# Altium schematic sheet CKP_CMP.SchDoc
size 420 x 297 mm; SheetNumber: 5; SheetTotal: 5
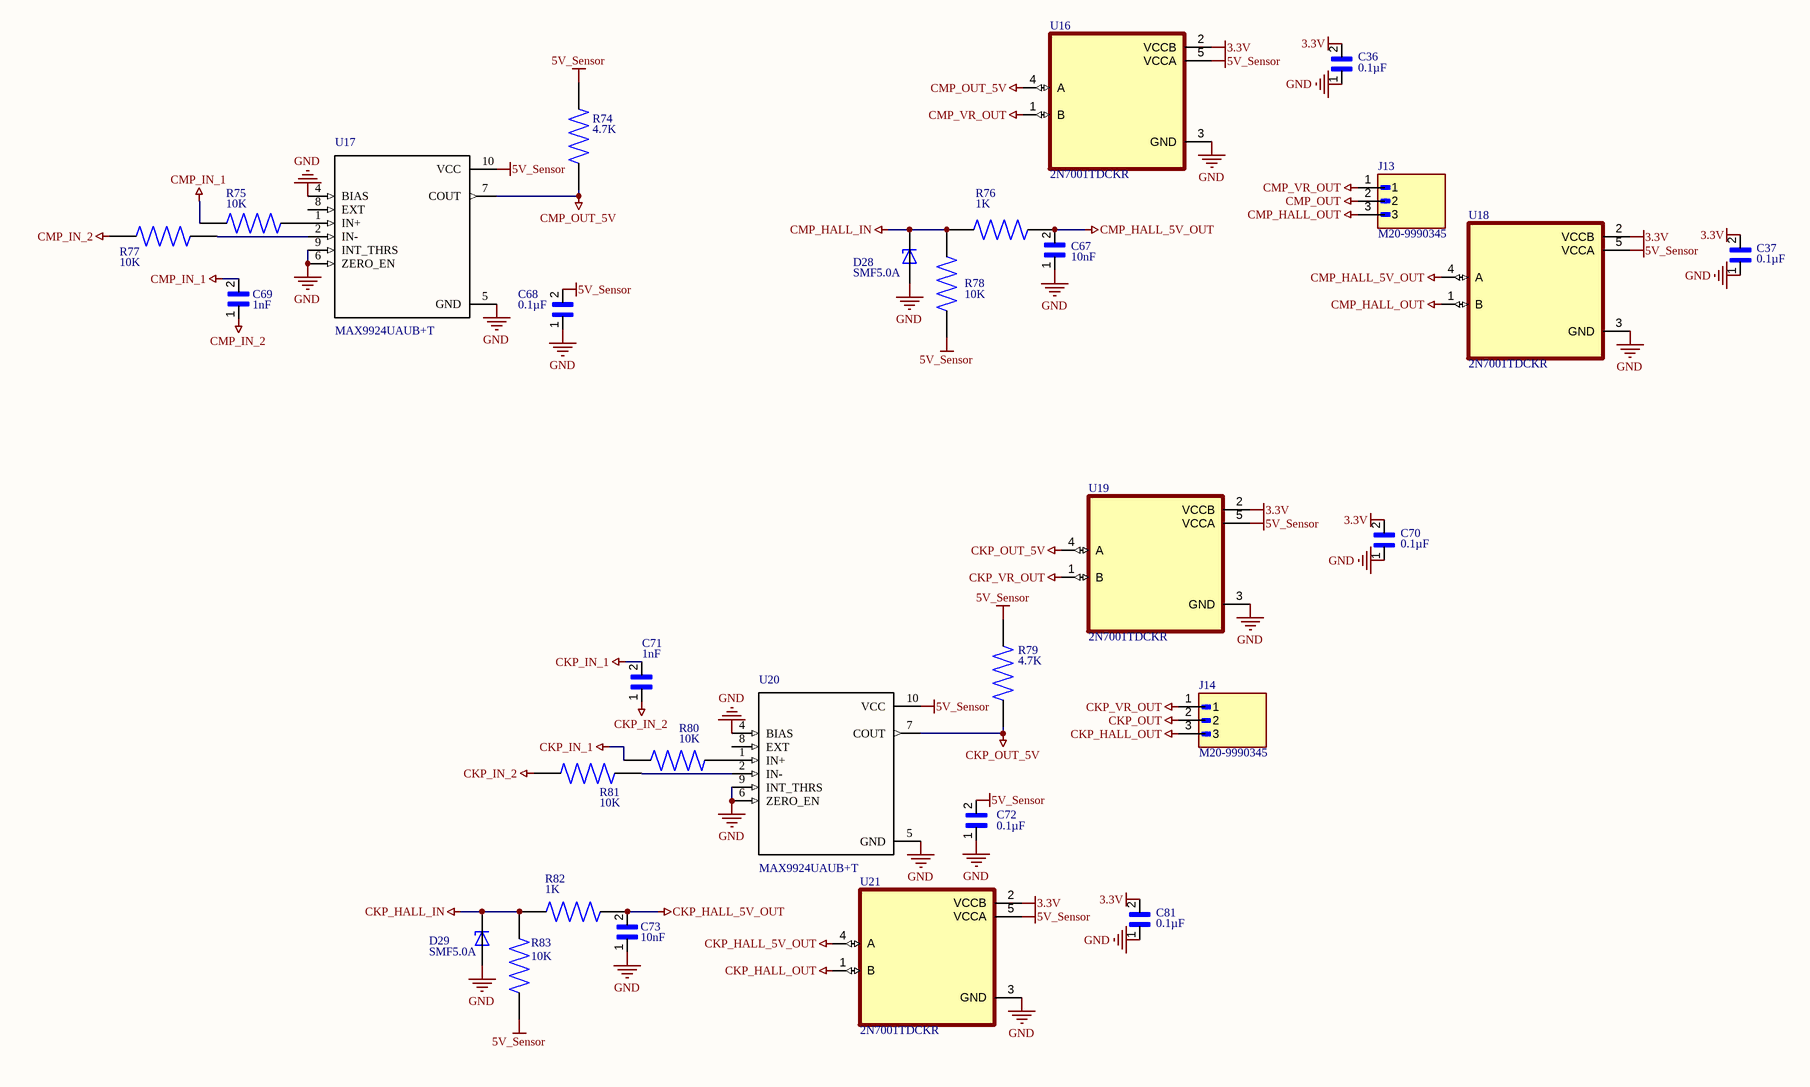
[diagram p0: CKP_CMP.SchDoc]

## Parts
C36  0.1µF  [CAPC1608X90N]
C37  0.1µF  [CAPC1608X90N]
C67  10nF  [CAPC1608X90N]
C68  0.1µF  [CAPC1608X90N]
C69  1nF  [CAPC1608X90N]
C70  0.1µF  [CAPC1608X90N]
C71  1nF  [CAPC1608X90N]
C72  0.1µF  [CAPC1608X90N]
C73  10nF  [CAPC1608X90N]
C81  0.1µF  [CAPC1608X90N]
D28  SMF5.0A  [SODFL3718X102N]
D29  SMF5.0A  [SODFL3718X102N]
J13  M20-9990345  [HARWIN_M20-9990345]
J14  M20-9990345  [HARWIN_M20-9990345]
R74  4.7K  [RESC3116X65N]
R75  10K  [RESC3116X65N]
R76  1K  [RESC3116X65N]
R77  10K  [RESC3116X65N]
R78  10K  [RESC3116X65N]
R79  4.7K  [RESC3116X65N]
R80  10K  [RESC3116X65N]
R81  10K  [RESC3116X65N]
R82  1K  [RESC3116X65N]
R83  10K  [RESC3116X65N]
U16  2N7001TDCKR  [SOT65P210X110-5N]
U17  MAX9924UAUB+T  [*SOP50P490X110-10N]
U18  2N7001TDCKR  [SOT65P210X110-5N]
U19  2N7001TDCKR  [SOT65P210X110-5N]
U20  MAX9924UAUB+T  [*SOP50P490X110-10N]
U21  2N7001TDCKR  [SOT65P210X110-5N]

## Nets
3.3V: C36.2 C37.2 C70.2 C81.2 U16.2(VCCB) U18.2(VCCB) U19.2(VCCB) U21.2(VCCB)
5V_Sensor: C68.2 C72.2 R74.2 R78.1 R79.2 R83.1 U16.5(VCCA) U17.10(VCC) U18.5(VCCA) U19.5(VCCA) U20.10(VCC) U21.5(VCCA)
CKP_HALL_5V_OUT: C73.2 R82.1 U21.4(A)
CKP_HALL_IN: D29.C R82.2 R83.2
CKP_HALL_OUT: J14.3 U21.1(B)
CKP_IN_1: C71.2 R80.1
CKP_IN_2: C71.1 R81.1
CKP_OUT: J14.2
CKP_OUT_5V: R79.1 U19.4(A) U20.7(COUT)
CKP_VR_OUT: J14.1 U19.1(B)
CMP_HALL_5V_OUT: C67.2 R76.1 U18.4(A)
CMP_HALL_IN: D28.C R76.2 R78.2
CMP_HALL_OUT: J13.3 U18.1(B)
CMP_IN_1: C69.2 R75.1
CMP_IN_2: C69.1 R77.1
CMP_OUT: J13.2
CMP_OUT_5V: R74.1 U16.4(A) U17.7(COUT)
CMP_VR_OUT: J13.1 U16.1(B)
GND: C36.1 C37.1 C67.1 C68.1 C70.1 C72.1 C73.1 C81.1 D28.A D29.A U16.3(GND) U17.4(BIAS) U17.5(GND) U17.6(ZERO_EN) U17.9(INT_THRS) U18.3(GND) U19.3(GND) U20.4(BIAS) U20.5(GND) U20.6(ZERO_EN) U20.9(INT_THRS) U21.3(GND)
NetR75_2: R75.2 U17.1(IN+)
NetR77_2: R77.2 U17.2(IN-)
NetR80_2: R80.2 U20.1(IN+)
NetR81_2: R81.2 U20.2(IN-)

Not connected (* = marked no-connect by the designer): U17 8(EXT); U20 8(EXT)

## Notes on the sheet
- THIS DOCUMENT AND THE DATA DISCLOSED HEREIN OR
- HEREWITH IS THE PROPERTY OF ALTIUM LIMITED AND MAY
- DWG NO:
- REVISION
- REV:
- DESCRIPTION
- DATE
- APPROVED
- BE FREELY DISTRIBUTED IN WHOLE. NO RIGHTS ARE
- RESERVED OR EXPRESS OR IMPLIED WARANTEE GIVEN.
- ENG:
- APPROVALS
- PROJECT
- DSN:
- CHK:
- REFERENCE DOCUMENTS
- PROJECT REVISION:
- TITLE
- DOCUMENT REVISION:
- DESIGN ITEM:
- BOM:
- FAB DWG:
- PCB DWG:
- ASSY DWG:
- SCALE:
- A3
- SIZE
- CAGE CODE
- FILE NAME
- DWG NO.
- SHEET
- OF
- REV

## Library data of the parts
C36 C37 C67-C73 C81 = 06035C104MAZ2A: Multilayer Ceramic Capacitors MLCC - SMD/SMT; Package: None; Price: None; Value: *; MP: 06035C104MAZ2A; Availability: Unavailable
D28 D29 = SMF5.0A: 200W, 6.7V, 5%, Unidirectional, TVS; MF: Taiwan Semiconductor; SnapEDA_Link: https://www.snapeda.com/parts/SMF5.0A/taiwan/view-part/?ref=snap; Package: SOD-123W-2 Taiwan Semiconductor; Value: *; MP: SMF5.0A; Check_prices: https://www.snapeda.com/parts/SMF5.0A/taiwan/view-part/?ref=eda
J13 J14 = M20-9990345: 2.54mm (0.1) Pitch SIL Vertical Throughboard Pin Header, 6.1mm mating pin height, gold (hi-temp mould), 3 contacts; MF: Harwin; SnapEDA_Link: https://www.snapeda.com/parts/M20-9990345/Harwin+Inc./view-part/?ref=snap; Package: None; Value: *; MP: M20-9990345; Check_prices: https://www.snapeda.com/parts/M20-9990345/Harwin+Inc./view-part/?ref=eda
R74-R83 = AA1206JR-07470RL: Package: None; Price: None; Value: *; MP: AA1206JR-07470RL; Availability: Unavailable
U16 U18 U19 U21 = 2N7001TDCKR: 1-bit dual-supply buffered voltage signal converter; MF: Texas Instruments; SnapEDA_Link: https://www.snapeda.com/parts/2N7001TDCKR/Texas+Instruments/view-part/?ref=snap; Package: SC70-5 Texas Instruments; Value: *; MP: 2N7001TDCKR; Check_prices: https://www.snapeda.com/parts/2N7001TDCKR/Texas+Instruments/view-part/?ref=eda
U17 U20 = MAX9924UAUB+T: SnapEDA_Link: https://www.snapeda.com/parts/MAX9924UAUB+T/Maxim+Integrated/view-part/?ref=snap; Check_prices: https://www.snapeda.com/parts/MAX9924UAUB+T/Maxim+Integrated/view-part/?ref=eda; Value: *